# Altium schematic sheet [5] RK3399_EDP_CSI_HDMI.SchDoc: RK3399, EDP, CSI and HDMI
size B; DocumentNumber: I; Revision: 01; SheetNumber: 5; SheetTotal: 19
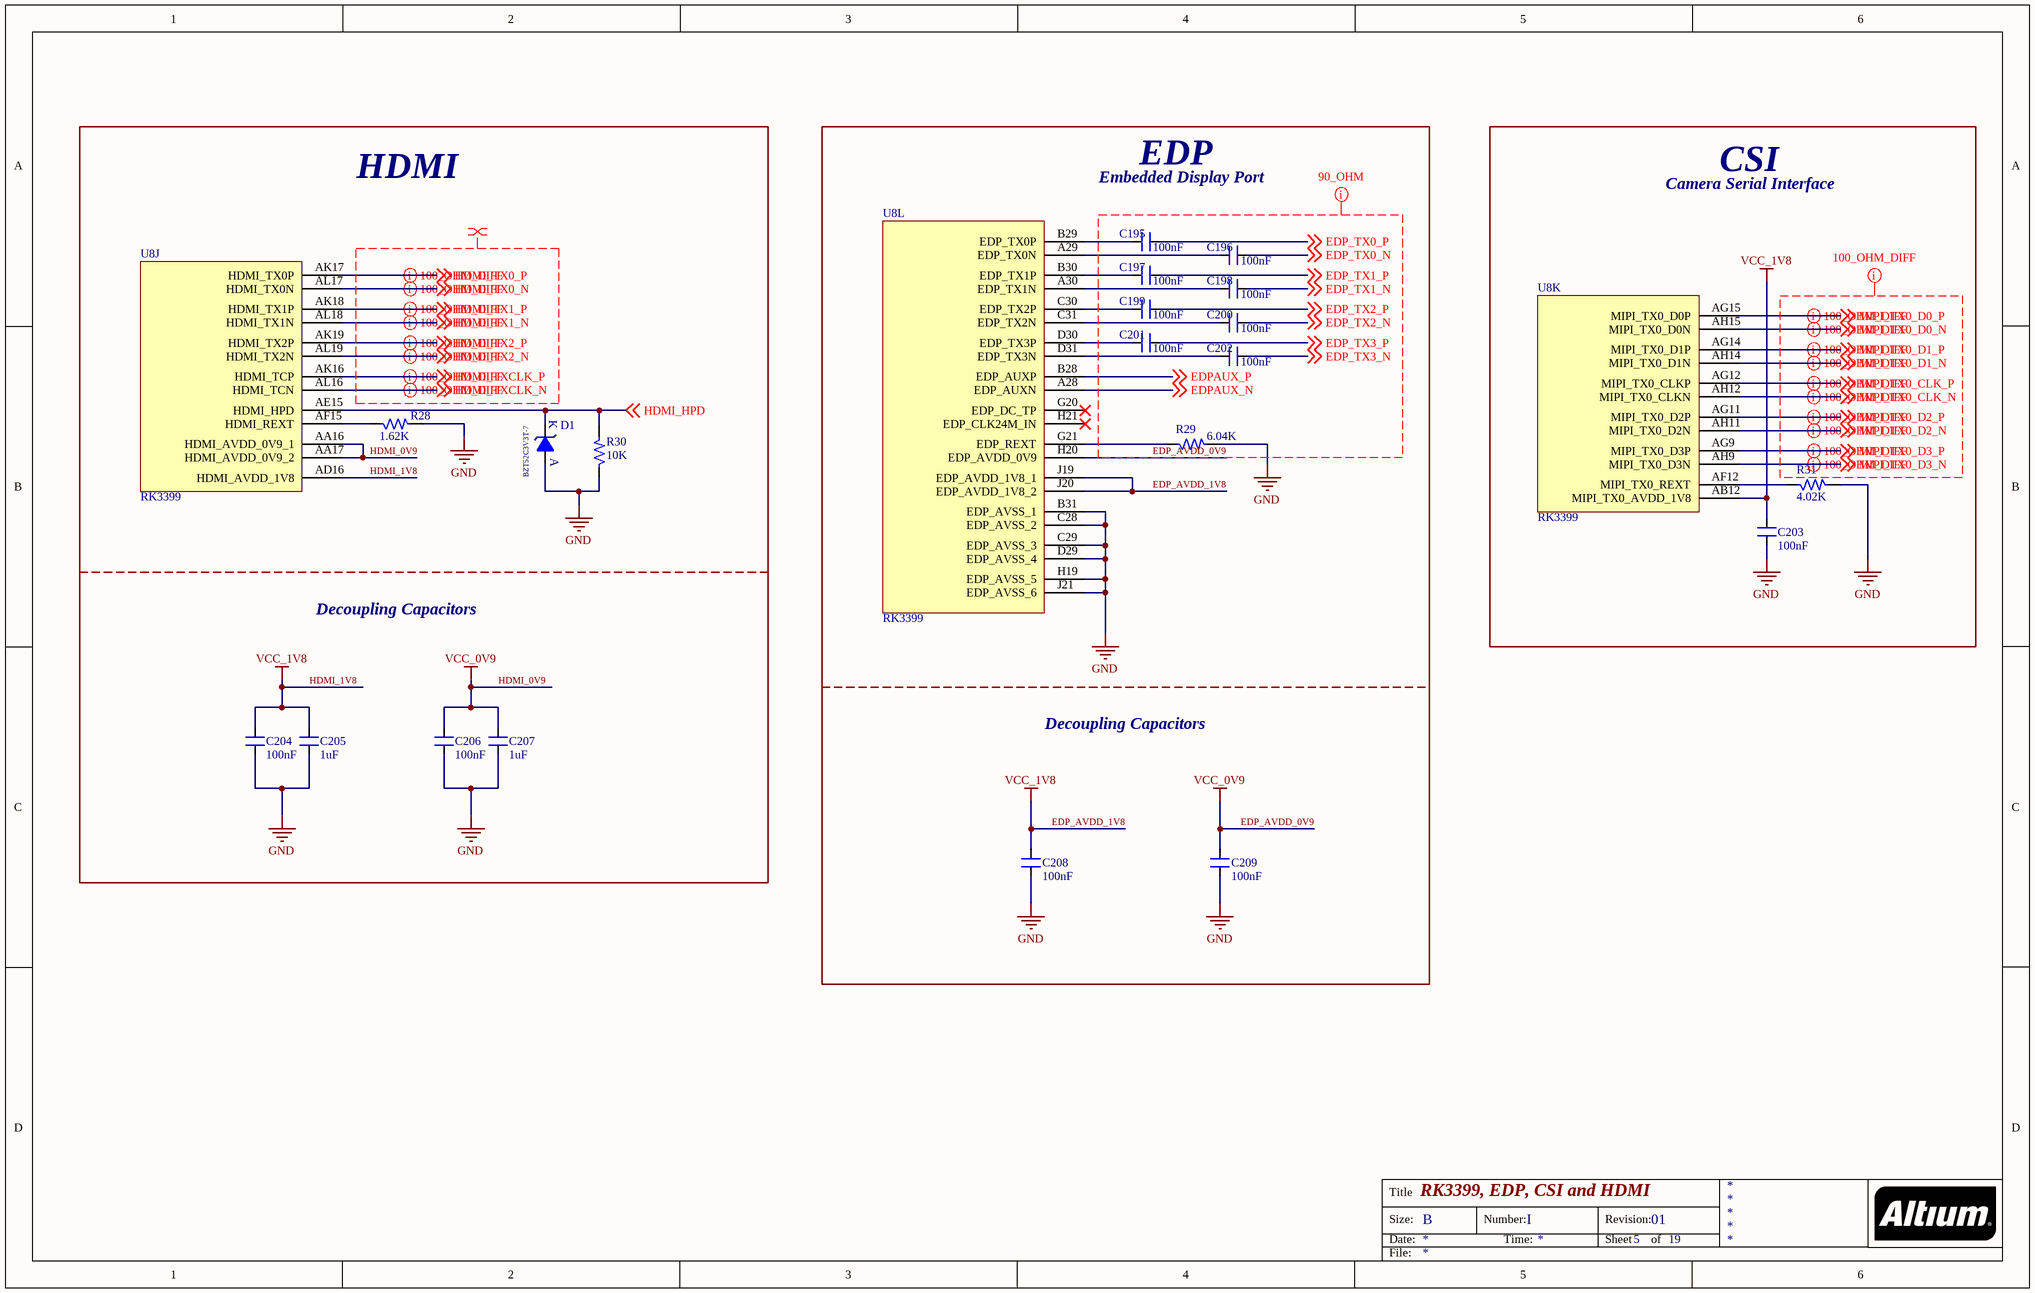
[diagram p0: [5] RK3399_EDP_CSI_HDMI.SchDoc]

## Parts
C195  100nF  [CAP_0201]
C196  100nF  [CAP_0201]
C197  100nF  [CAP_0201]
C198  100nF  [CAP_0201]
C199  100nF  [CAP_0201]
C200  100nF  [CAP_0201]
C201  100nF  [CAP_0201]
C202  100nF  [CAP_0201]
C203  100nF  [CAP_0201]
C204  100nF  [CAP_0201]
C205  1uF  [CAP_0201]
C206  100nF  [CAP_0201]
C207  1uF  [CAP_0201]
C208  100nF  [CAP_0201]
C209  100nF  [CAP_0201]
D1  BZT52C3V3T-7  [DIO_SOD523]
R28  1.62K  [RES_0201]
R29  6.04K  [RES_0201]
R30  10K  [RES_0201]
R31  4.02K  [RES_0201]
U8  RK3399  [FBGA828_23_826X826]  (parts J,K,L of 24)

## Blocks framed on the sheet
HDMI: C204-C207 D1 R28 R30 U8
EDP: C195-C202 C208 C209 R29 U8
CSI: C203 R31 U8

## Nets
EDP_AVDD_0V9: C206.2 C207.2 C209.2 U8.AA16(HDMI_AVDD_0V9_1) U8.AA17(HDMI_AVDD_0V9_2) U8.H20(EDP_AVDD_0V9)  [also labelled HDMI_0V9, VCC_0V9]
EDP_AVDD_1V8: C203.2 C204.2 C205.2 C208.2 U8.AB12(MIPI_TX0_AVDD_1V8) U8.AD16(HDMI_AVDD_1V8) U8.J19(EDP_AVDD_1V8_1) U8.J20(EDP_AVDD_1V8_2)  [also labelled HDMI_1V8, VCC_1V8]
GND: C203.1 C204.1 C205.1 C206.1 C207.1 C208.1 C209.1 D1.A R28.2 R29.2 R30.1 R31.2 U8.B31(EDP_AVSS_1) U8.C28(EDP_AVSS_2) U8.C29(EDP_AVSS_3) U8.D29(EDP_AVSS_4) U8.H19(EDP_AVSS_5) U8.J21(EDP_AVSS_6)
EDP_TX0_N: C196.2 ; off-sheet EDP_TX0_N
EDP_TX0_P: C195.2 ; off-sheet EDP_TX0_P
EDP_TX1_N: C198.2 ; off-sheet EDP_TX1_N
EDP_TX1_P: C197.2 ; off-sheet EDP_TX1_P
EDP_TX2_N: C200.2 ; off-sheet EDP_TX2_N
EDP_TX2_P: C199.2 ; off-sheet EDP_TX2_P
EDP_TX3_N: C202.2 ; off-sheet EDP_TX3_N
EDP_TX3_P: C201.2 ; off-sheet EDP_TX3_P
EDPAUX_N: U8.A28(EDP_AUXN) ; off-sheet EDPAUX_N
EDPAUX_P: U8.B28(EDP_AUXP) ; off-sheet EDPAUX_P
HDMI_HPD: D1.K R30.2 U8.AE15(HDMI_HPD) ; off-sheet HDMI_HPD
HDMI_TX0_N: U8.AL17(HDMI_TX0N) ; off-sheet HDMI_TX0_N
HDMI_TX0_P: U8.AK17(HDMI_TX0P) ; off-sheet HDMI_TX0_P
HDMI_TX1_N: U8.AL18(HDMI_TX1N) ; off-sheet HDMI_TX1_N
HDMI_TX1_P: U8.AK18(HDMI_TX1P) ; off-sheet HDMI_TX1_P
HDMI_TX2_N: U8.AL19(HDMI_TX2N) ; off-sheet HDMI_TX2_N
HDMI_TX2_P: U8.AK19(HDMI_TX2P) ; off-sheet HDMI_TX2_P
HDMI_TXCLK_N: U8.AL16(HDMI_TCN) ; off-sheet HDMI_TXCLK_N
HDMI_TXCLK_P: U8.AK16(HDMI_TCP) ; off-sheet HDMI_TXCLK_P
MIPI_TX0_CLK_N: U8.AH12(MIPI_TX0_CLKN) ; off-sheet MIPI_TX0_CLK_N
MIPI_TX0_CLK_P: U8.AG12(MIPI_TX0_CLKP) ; off-sheet MIPI_TX0_CLK_P
MIPI_TX0_D0_N: U8.AH15(MIPI_TX0_D0N) ; off-sheet MIPI_TX0_D0_N
MIPI_TX0_D0_P: U8.AG15(MIPI_TX0_D0P) ; off-sheet MIPI_TX0_D0_P
MIPI_TX0_D1_N: U8.AH14(MIPI_TX0_D1N) ; off-sheet MIPI_TX0_D1_N
MIPI_TX0_D1_P: U8.AG14(MIPI_TX0_D1P) ; off-sheet MIPI_TX0_D1_P
MIPI_TX0_D2_N: U8.AH11(MIPI_TX0_D2N) ; off-sheet MIPI_TX0_D2_N
MIPI_TX0_D2_P: U8.AG11(MIPI_TX0_D2P) ; off-sheet MIPI_TX0_D2_P
MIPI_TX0_D3_N: U8.AH9(MIPI_TX0_D3N) ; off-sheet MIPI_TX0_D3_N
MIPI_TX0_D3_P: U8.AG9(MIPI_TX0_D3P) ; off-sheet MIPI_TX0_D3_P
NetC195_1: C195.1 U8.B29(EDP_TX0P)
NetC196_1: C196.1 U8.A29(EDP_TX0N)
NetC197_1: C197.1 U8.B30(EDP_TX1P)
NetC198_1: C198.1 U8.A30(EDP_TX1N)
NetC199_1: C199.1 U8.C30(EDP_TX2P)
NetC200_1: C200.1 U8.C31(EDP_TX2N)
NetC201_1: C201.1 U8.D30(EDP_TX3P)
NetC202_1: C202.1 U8.D31(EDP_TX3N)
NetR28_1: R28.1 U8.AF15(HDMI_REXT)
NetR29_1: R29.1 U8.G21(EDP_REXT)
NetR31_1: R31.1 U8.AF12(MIPI_TX0_REXT)

Not connected (* = marked no-connect by the designer): U8 G20(EDP_DC_TP)* H21(EDP_CLK24M_IN)*

## Layout directives
differential pair: HDMI_TX0_N, HDMI_TX0_P, HDMI_TX1_N, HDMI_TX1_P, HDMI_TX2_N, HDMI_TX2_P, HDMI_TXCLK_N, HDMI_TXCLK_P, MIPI_TX0_CLK_N, MIPI_TX0_CLK_P, MIPI_TX0_D0_N, MIPI_TX0_D0_P, MIPI_TX0_D1_N, MIPI_TX0_D1_P, MIPI_TX0_D2_N, MIPI_TX0_D2_P, MIPI_TX0_D3_N, MIPI_TX0_D3_P
mark named 100_OHM_DIFF: MIPI_TX0_CLK_N, MIPI_TX0_CLK_P, MIPI_TX0_D0_N, MIPI_TX0_D0_P, MIPI_TX0_D1_N, MIPI_TX0_D1_P, MIPI_TX0_D2_N, MIPI_TX0_D2_P, MIPI_TX0_D3_N, MIPI_TX0_D3_P
mark named 90_OHM: EDP_AVDD_0V9, EDP_TX0_N, EDP_TX0_P, EDP_TX1_N, EDP_TX1_P, EDP_TX2_N, EDP_TX2_P, EDP_TX3_N, EDP_TX3_P, EDPAUX_N, EDPAUX_P

## Notes on the sheet
- Embedded Display Port
- Camera Serial Interface
- Decoupling Capacitors
- Title
- Size:
- Date:
- B
- Number:
- Time:
- Revision:
- Sheet
- of
- File:

## Library data of the parts
C195-C204 C206 C208 C209 = CAP_100nF-25V-10%-0201: 0.1µF ±10% 25V Ceramic Capacitor X5R 0201 (0603 Metric) /; Manufacturer: TDK Corporation; Manufacturer Part Number: C0603X5R1E104K030BB; Case/Package: 0201; Supplier-1: Digikey
C205 C207 = CAP_1uF-16V-10%-0201: 1µF ±20% 16V Ceramic Capacitor X5R 0201 (0603 Metric) /; Manufacturer: Samsung Electro-Mechanics; Manufacturer Part Number: CL03A105MO3NRNH; Case/Package: 0201; Supplier-1: Digikey
D1 = DIO-Z_3.3V-300mW-SOD-523: Zener Diode 3.3V 300mW ±6% Surface Mount SOD-523 /; Manufacturer: Diodes Incorporated; Manufacturer Part Number: BZT52C3V3T-7; Case/Package: SOD523; Supplier-1: Digikey
R28 = RES_1.62K-0.05W-1%-0201: 1.62 kOhms ±1% 0.05W, 1/20W Chip Resistor 0201 (0603 Metric) Automotive AEC-Q200 Thick Film /; Manufacturer: Panasonic Electronic Components; Manufacturer Part Number: ERJ-1GNF1621C; Case/Package: 0201; Supplier-1: Digikey
R29 = RES_6.04K-0.05W-1%-0201: 6.04 kOhms ±1% 0.05W, 1/20W Chip Resistor 0201 (0603 Metric) Thick Film /; Manufacturer: Panasonic Electronic Components; Manufacturer Part Number: ERJ-1GEF6041C; Case/Package: 0201; Supplier-1: Digikey
R30 = RES_10K-0.05W-1%-0201: 10 kOhms ±1% 0.05W, 1/20W Chip Resistor 0201 (0603 Metric) Thick Film /; Manufacturer: Stackpole Electronics Inc; Manufacturer Part Number: RMCF0201FT10K0; Case/Package: 0201; Supplier-1: Digikey
R31 = RES_4.02K-0.05W-1%-0201: 4.02 kOhms ±1% 0.05W, 1/20W Chip Resistor 0201 (0603 Metric) Thick Film /; Manufacturer: Yageo; Manufacturer Part Number: RC0201FR-074K02L; Case/Package: 0201; Supplier-1: Digikey
U8 = IC_RK3399-FCBGA828: RK3399 is a low power, high performance processor for computing, personal mobile.; Manufacturer: Rockchip; Manufacturer Part Number: RK3399; Case/Package: FCBGA828; Supplier-1: Rockchip